# EAGLE schematic flashbutton (EAGLE 6.5.0)
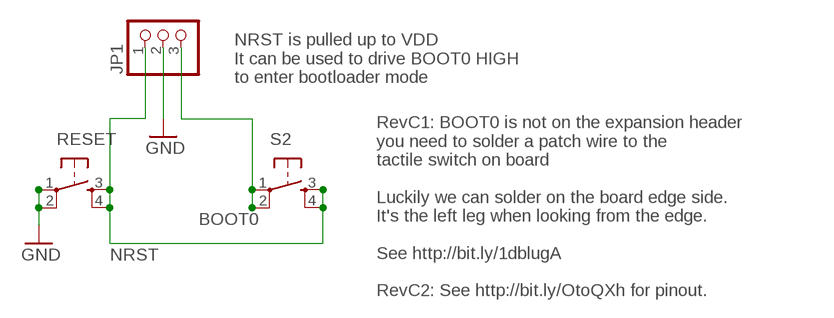
[diagram p0: schematic, sheet 1]

## Parts
JP1  PINHD-1X3  [1X03]
RESET  TAC_SWITCHSMD  [TACTILE_SWITCH_SMD]
S2  TAC_SWITCHSMD  [TACTILE_SWITCH_SMD]

## Nets
BOOT0: JP1.3 S2.1 S2.2
GND: JP1.2 RESET.1 RESET.2
NRST: JP1.1 RESET.3 RESET.4 S2.3 S2.4

## Notes on the sheet
- NRST is pulled up to VDD
  It can be used to drive BOOT0 HIGH
  to enter bootloader mode
- RevC1: BOOT0 is not on the expansion header
  you need to solder a patch wire to the 
  tactile switch on board 
  
  Luckily we can solder on the board edge side.
  It's the left leg when looking from the edge.
  
  See http://bit.ly/1dblugA
  
  RevC2: See http://bit.ly/OtoQXh for pinout.

## Library data of the parts
JP1 = pinhead:PINHD-1X3: PIN HEADER
RESET S2 = SparkFun-Electromechanical:TAC_SWITCH: Momentary Switch Button commonly used for reset or general input. Spark Fun Electronics SKU : COM-00097 SMT- SWCH-08247; PROD_ID: SWCH-08247